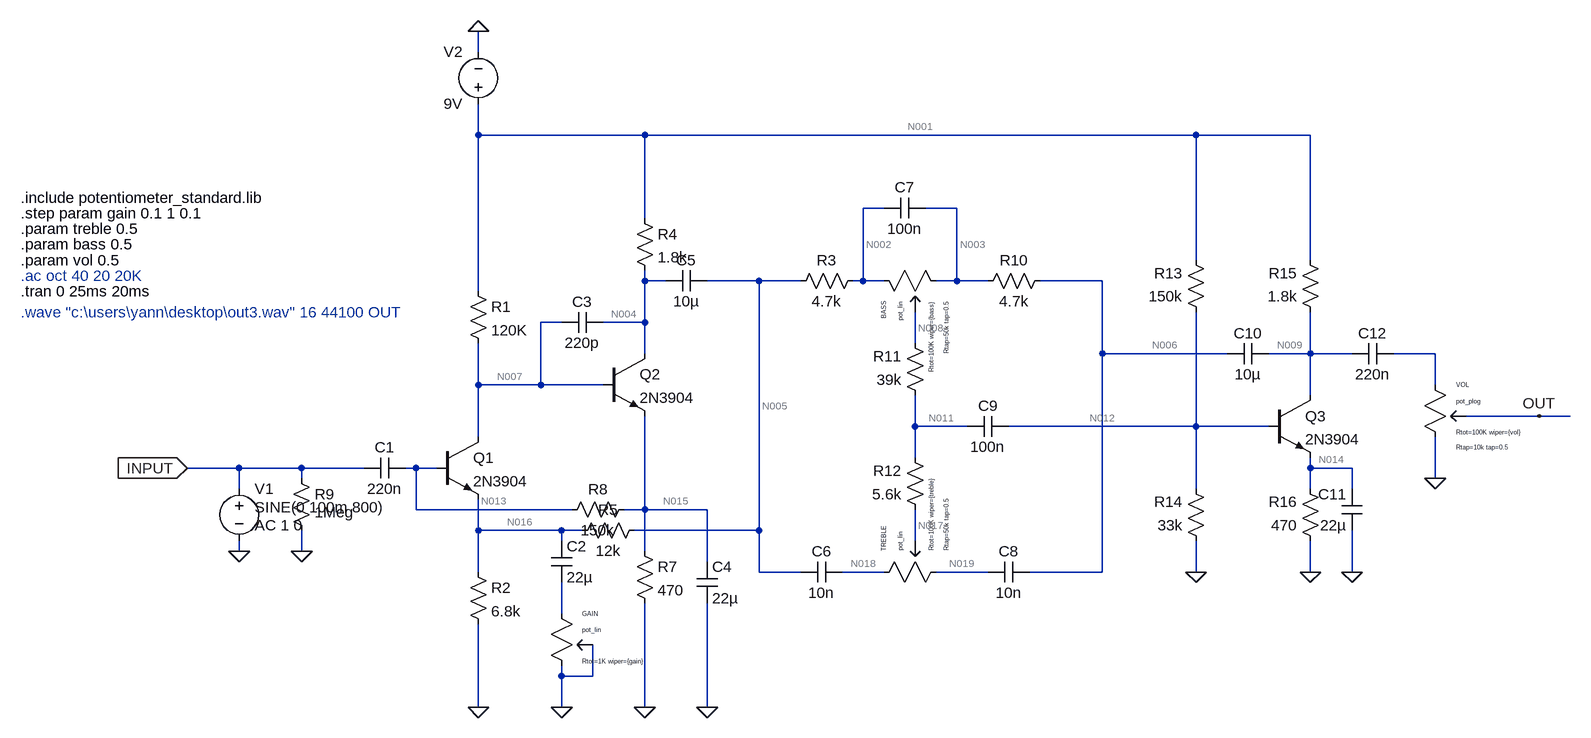
[diagram p0: schematic overdriver.asc]
overdriver.asc, the LTspice schematic file:
Version 4
SHEET 1 2004 680
WIRE 208 -448 208 -480
WIRE 208 -320 208 -368
WIRE 464 -320 208 -320
WIRE 1312 -320 464 -320
WIRE 1488 -320 1312 -320
WIRE 832 -208 800 -208
WIRE 944 -208 896 -208
WIRE 464 -192 464 -320
WIRE 1312 -128 1312 -320
WIRE 1488 -128 1488 -320
WIRE 464 -96 464 -112
WIRE 496 -96 464 -96
WIRE 640 -96 560 -96
WIRE 704 -96 640 -96
WIRE 800 -96 800 -208
WIRE 800 -96 784 -96
WIRE 832 -96 800 -96
WIRE 944 -96 944 -208
WIRE 944 -96 912 -96
WIRE 992 -96 944 -96
WIRE 1168 -96 1072 -96
WIRE 208 -80 208 -320
WIRE 336 -32 304 -32
WIRE 464 -32 464 -96
WIRE 464 -32 400 -32
WIRE 880 0 880 -48
WIRE 464 16 464 -32
WIRE 1168 16 1168 -96
WIRE 1360 16 1168 16
WIRE 1488 16 1488 -48
WIRE 1488 16 1424 16
WIRE 1552 16 1488 16
WIRE 1680 16 1616 16
WIRE 208 64 208 0
WIRE 304 64 304 -32
WIRE 304 64 208 64
WIRE 400 64 304 64
WIRE 1680 64 1680 16
WIRE 1488 80 1488 16
WIRE 1840 112 1728 112
WIRE 1888 112 1840 112
WIRE 880 128 880 80
WIRE 960 128 880 128
WIRE 1312 128 1312 -48
WIRE 1312 128 1024 128
WIRE 1424 128 1312 128
WIRE 208 144 208 64
WIRE 880 176 880 128
WIRE -160 192 -240 192
WIRE -64 192 -160 192
WIRE 32 192 -64 192
WIRE 112 192 96 192
WIRE 144 192 112 192
WIRE 1488 192 1488 176
WIRE 1552 192 1488 192
WIRE -64 208 -64 192
WIRE 1680 208 1680 144
WIRE -160 224 -160 192
WIRE 1312 224 1312 128
WIRE 1488 224 1488 192
WIRE 1552 224 1552 192
WIRE 112 256 112 192
WIRE 352 256 112 256
WIRE 464 256 464 112
WIRE 464 256 432 256
WIRE 560 256 464 256
WIRE 208 288 208 240
WIRE 336 288 208 288
WIRE 368 288 336 288
WIRE 640 288 640 -96
WIRE 640 288 448 288
WIRE 336 304 336 288
WIRE 880 304 880 256
WIRE -160 320 -160 304
WIRE -64 320 -64 288
WIRE 464 320 464 256
WIRE 560 336 560 256
WIRE 208 352 208 288
WIRE 640 352 640 288
WIRE 704 352 640 352
WIRE 832 352 768 352
WIRE 992 352 912 352
WIRE 1168 352 1168 16
WIRE 1168 352 1056 352
WIRE 1312 352 1312 304
WIRE 1488 352 1488 304
WIRE 1552 352 1552 288
WIRE 336 416 336 368
WIRE 336 512 336 496
WIRE 384 512 384 464
WIRE 384 512 336 512
WIRE 208 560 208 432
WIRE 336 560 336 512
WIRE 464 560 464 400
WIRE 560 560 560 400
FLAG -240 192 INPUT
IOPIN -240 192 In
FLAG -160 320 0
FLAG 208 560 0
FLAG 336 560 0
FLAG 208 -480 0
FLAG 464 560 0
FLAG 560 560 0
FLAG -64 320 0
FLAG 1312 352 0
FLAG 1488 352 0
FLAG 1552 352 0
FLAG 1680 208 0
FLAG 1840 112 OUT
SYMBOL cap 96 176 R90
WINDOW 0 0 32 VBottom 2
WINDOW 3 32 32 VTop 2
SYMATTR InstName C1
SYMATTR Value 220n
SYMBOL voltage -160 208 R0
WINDOW 3 24 44 Left 2
WINDOW 123 24 72 Left 2
WINDOW 39 0 0 Left 2
SYMATTR Value SINE(0 100m 800)
SYMATTR Value2 AC 1 0
SYMATTR InstName V1
SYMBOL npn 144 144 R0
SYMATTR InstName Q1
SYMATTR Value 2N3904
SYMBOL voltage 208 -352 R180
WINDOW 0 24 96 Left 2
WINDOW 3 24 16 Left 2
WINDOW 123 0 0 Left 2
WINDOW 39 0 0 Left 2
SYMATTR InstName V2
SYMATTR Value 9V
SYMBOL res 192 -96 R0
SYMATTR InstName R1
SYMATTR Value 120K
SYMATTR SpiceLine tol=1% pwr=0.25w
SYMBOL res 192 336 R0
SYMATTR InstName R2
SYMATTR Value 6.8k
SYMATTR SpiceLine tol=1% pwr=0.25W
SYMBOL cap 320 304 R0
SYMATTR InstName C2
SYMATTR Value 22µ
SYMBOL npn 400 16 R0
SYMATTR InstName Q2
SYMATTR Value 2N3904
SYMBOL res 448 -208 R0
SYMATTR InstName R4
SYMATTR Value 1.8k
SYMATTR SpiceLine tol=1% pwr=0.25w
SYMBOL cap 400 -48 R90
WINDOW 0 0 32 VBottom 2
WINDOW 3 32 32 VTop 2
SYMATTR InstName C3
SYMATTR Value 220p
SYMBOL res 448 304 R0
SYMATTR InstName R7
SYMATTR Value 470
SYMATTR SpiceLine tol=1% pwr=0.25w
SYMBOL res 448 240 R90
WINDOW 0 0 56 VBottom 2
WINDOW 3 32 56 VTop 2
SYMATTR InstName R8
SYMATTR Value 150k
SYMATTR SpiceLine tol=1% pwr=0.25w
SYMBOL cap 544 336 R0
SYMATTR InstName C4
SYMATTR Value 22µ
SYMBOL cap 560 -112 R90
WINDOW 0 0 32 VBottom 2
WINDOW 3 32 32 VTop 2
SYMATTR InstName C5
SYMATTR Value 10µ
SYMBOL res -80 192 R0
WINDOW 3 36 68 Left 2
SYMATTR Value 1Meg
SYMATTR InstName R9
SYMBOL potentiometer_standard 320 400 R0
WINDOW 39 48 69 Left 2
SYMATTR SpiceLine ""
SYMATTR InstName GAIN
SYMATTR Value Rtot=1K wiper={gain}
SYMBOL res 800 -112 R90
WINDOW 0 0 56 VBottom 2
WINDOW 3 32 56 VTop 2
SYMATTR InstName R3
SYMATTR Value 4.7k
SYMATTR SpiceLine tol=1% pwr=0.25w
SYMBOL cap 768 336 R90
WINDOW 0 0 32 VBottom 2
WINDOW 3 32 32 VTop 2
SYMATTR InstName C6
SYMATTR Value 10n
SYMBOL potentiometer_standard 816 368 R270
SYMATTR InstName TREBLE
SYMATTR Value Rtot=100K wiper={treble}
SYMATTR SpiceLine Rtap=50k tap=0.5
SYMBOL potentiometer_standard 816 -112 M90
SYMATTR InstName BASS
SYMATTR Value Rtot=100K wiper={bass}
SYMATTR SpiceLine Rtap=50k tap=0.5
SYMBOL res 1088 -112 R90
WINDOW 0 0 56 VBottom 2
WINDOW 3 32 56 VTop 2
SYMATTR InstName R10
SYMATTR Value 4.7k
SYMATTR SpiceLine tol=1% pwr=0.25w
SYMBOL cap 896 -224 R90
WINDOW 0 0 32 VBottom 2
WINDOW 3 32 32 VTop 2
SYMATTR InstName C7
SYMATTR Value 100n
SYMBOL cap 1056 336 R90
WINDOW 0 0 32 VBottom 2
WINDOW 3 32 32 VTop 2
SYMATTR InstName C8
SYMATTR Value 10n
SYMBOL res 896 96 R180
WINDOW 0 36 76 Left 2
WINDOW 3 36 40 Left 2
SYMATTR InstName R11
SYMATTR Value 39k
SYMATTR SpiceLine tol=1% pwr=0.25w
SYMBOL res 896 272 R180
WINDOW 0 36 76 Left 2
WINDOW 3 36 40 Left 2
SYMATTR InstName R12
SYMATTR Value 5.6k
SYMATTR SpiceLine tol=1% pwr=0.25w
SYMBOL cap 1024 112 R90
WINDOW 0 0 32 VBottom 2
WINDOW 3 32 32 VTop 2
SYMATTR InstName C9
SYMATTR Value 100n
SYMBOL res 1328 -32 R180
WINDOW 0 36 76 Left 2
WINDOW 3 36 40 Left 2
SYMATTR InstName R13
SYMATTR Value 150k
SYMATTR SpiceLine tol=1% pwr=0.25w
SYMBOL res 1328 320 R180
WINDOW 0 36 76 Left 2
WINDOW 3 36 40 Left 2
SYMATTR InstName R14
SYMATTR Value 33k
SYMATTR SpiceLine tol=1% pwr=0.25w
SYMBOL cap 1424 0 R90
WINDOW 0 0 32 VBottom 2
WINDOW 3 32 32 VTop 2
SYMATTR InstName C10
SYMATTR Value 10µ
SYMBOL res 1504 -32 R180
WINDOW 0 36 76 Left 2
WINDOW 3 36 40 Left 2
SYMATTR InstName R15
SYMATTR Value 1.8k
SYMATTR SpiceLine tol=1% pwr=0.25w
SYMBOL npn 1424 80 R0
SYMATTR InstName Q3
SYMATTR Value 2N3904
SYMBOL res 1504 320 R180
WINDOW 0 36 76 Left 2
WINDOW 3 36 40 Left 2
SYMATTR InstName R16
SYMATTR Value 470
SYMATTR SpiceLine tol=1% pwr=0.25w
SYMBOL cap 1568 288 R180
WINDOW 0 24 56 Left 2
WINDOW 3 24 8 Left 2
SYMATTR InstName C11
SYMATTR Value 22µ
SYMBOL cap 1616 0 R90
WINDOW 0 0 32 VBottom 2
WINDOW 3 32 32 VTop 2
SYMATTR InstName C12
SYMATTR Value 220n
SYMBOL potentiometer_standard 1664 48 R0
SYMATTR InstName VOL
SYMATTR Value Rtot=100K wiper={vol}
SYMATTR SpiceLine Rtap=10k tap=0.5
SYMATTR SpiceModel pot_plog
SYMBOL res 464 272 R90
WINDOW 0 0 56 VBottom 2
WINDOW 3 32 56 VTop 2
SYMATTR InstName R5
SYMATTR Value 12k
TEXT -496 -80 Left 2 !.tran 0 25ms 20ms
TEXT -496 -200 Left 2 !.step param gain 0.1 1 0.1
TEXT -496 -224 Left 2 !.include potentiometer_standard.lib
TEXT -496 -176 Left 2 !.param treble 0.5
TEXT -496 -152 Left 2 !.param bass 0.5
TEXT -496 -128 Left 2 !.param vol 0.5
TEXT -496 -104 Left 2 ;.ac oct 40 20 20K
TEXT -496 -48 Left 2 ;.wave "c:\\users\\yann\\desktop\\out3.wav" 16 44100 OUT

The netlist it stands for:
* overdriver.asc
C1 N013 INPUT 220n
V1 INPUT 0 SINE(0 100m 800) AC 1 0
Q1 N007 N013 N016 0 2N3904
V2 N001 0 9V
R1 N001 N007 120K tol=1% pwr=0.25w
R2 N016 0 6.8k tol=1% pwr=0.25W
C2 N016 N020 22µ
Q2 N004 N007 N015 0 2N3904
R4 N001 N004 1.8k tol=1% pwr=0.25w
C3 N004 N007 220p
R7 N015 0 470 tol=1% pwr=0.25w
R8 N015 N013 150k tol=1% pwr=0.25w
C4 N015 0 22µ
C5 N005 N004 10µ
R9 INPUT 0 1Meg
XGAIN N020 0 0 pot_lin Rtot=1K wiper={gain}  ; pins A B C
R3 N002 N005 4.7k tol=1% pwr=0.25w
C6 N018 N005 10n
XTREBLE N018 N019 N017 pot_lin Rtot=100K wiper={treble} Rtap=50k tap=0.5  ; pins A B C
XBASS N002 N003 N008 pot_lin Rtot=100K wiper={bass} Rtap=50k tap=0.5  ; pins A B C
R10 N006 N003 4.7k tol=1% pwr=0.25w
C7 N003 N002 100n
C8 N006 N019 10n
R11 N011 N008 39k tol=1% pwr=0.25w
R12 N017 N011 5.6k tol=1% pwr=0.25w
C9 N012 N011 100n
R13 N012 N001 150k tol=1% pwr=0.25w
R14 0 N012 33k tol=1% pwr=0.25w
C10 N009 N006 10µ
R15 N009 N001 1.8k tol=1% pwr=0.25w
Q3 N009 N012 N014 0 2N3904
R16 0 N014 470 tol=1% pwr=0.25w
C11 0 N014 22µ
C12 N010 N009 220n
XVOL N010 0 OUT pot_plog Rtot=100K wiper={vol} Rtap=10k tap=0.5  ; pins A B C
R5 N005 N016 12k
.model NPN NPN
.model PNP PNP
.lib standard.bjt
.tran 0 25ms 20ms
.step param gain 0.1 1 0.1
.include potentiometer_standard.lib
.param treble 0.5
.param bass 0.5
.param vol 0.5
* .ac oct 40 20 20K
* .wave "c:\users\yann\desktop\out3.wav" 16 44100 OUT
.backanno
.end

* Results of the author's LTspice run, read from the files saved beside the schematic
* Operating Point (first step), zero values left out:
*   gain = 100 m
*   V(n013) = 951.7 mV
*   V(n007) = 1.652 V
*   V(n016) = 372 mV
*   V(n001) = 9 V
*   V(n004) = 5.263 V
*   V(n015) = 978.7 mV
*   V(n005) = 372 mV
*   V(n002) = 372 mV
*   V(n018) = 372 mV
*   V(n017) = 372 mV
*   V(n019) = 372 mV
*   V(n008) = 372 mV
*   V(n003) = 372 mV
*   V(n006) = 372 mV
*   V(n011) = 372 mV
*   V(n012) = 1.475 V
*   V(n009) = 5.921 V
*   V(n014) = 806.4 mV
*   Ic(Q3) = 1.71 mA
*   Ib(Q3) = 5.481 µA
*   Ie(Q3) = -1.716 mA
*   Ic(Q2) = 2.076 mA
*   Ib(Q2) = 6.712 µA
*   Ie(Q2) = -2.083 mA
*   Ic(Q1) = 54.52 µA
*   Ib(Q1) = 180.5 nA
*   Ie(Q1) = -54.7 µA
*   I(R16) = -1.716 mA
*   I(R15) = -1.71 mA
*   I(R14) = -44.69 µA
*   I(R13) = -50.17 µA
*   I(R8) = 180.5 nA
*   I(R7) = 2.082 mA
*   I(R4) = 2.076 mA
*   I(R2) = 54.7 µA
*   I(R1) = 61.23 µA
*   I(V2) = -3.898 mA
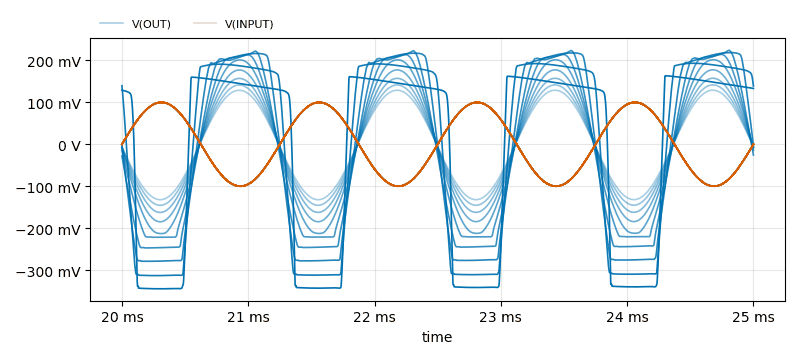
[diagram p1: Transient Analysis of overdriver.asc, plotted from the saved traces]
* Transient Analysis, 10 runs:
*   V(OUT) [gain=0.1]: min -131.8 mV, max 128.7 mV, average -632.4 µV, rms 92.25 mV, last -5.689 mV
*   V(OUT) [gain=0.2]: min -145.1 mV, max 141.3 mV, average -711.3 µV, rms 101.5 mV, last -6.174 mV
*   V(OUT) [gain=0.3]: min -162.1 mV, max 157.1 mV, average -811.6 µV, rms 113.2 mV, last -6.743 mV
*   V(OUT) [gain=0.4]: min -184.4 mV, max 177.2 mV, average -956.2 µV, rms 128.4 mV, last -7.383 mV
*   V(OUT) [gain=0.5]: min -212.3 mV, max 201.1 mV, average -1.286 mV, rms 148.6 mV, last -8.008 mV
*   V(OUT) [gain=0.6]: min -221.1 mV, max 213.8 mV, average -4.079 mV, rms 167.9 mV, last -14.41 mV
*   V(OUT) [gain=0.7]: min -246.5 mV, max 223.4 mV, average -11.2 mV, rms 189 mV, last -25.62 mV
*   V(OUT) [gain=0.8]: min -278.2 mV, max 218 mV, average -12.19 mV, rms 212.3 mV, last -3.024 mV
*   V(INPUT) [gain=0.1]: min -99.76 mV, max 99.73 mV, average -77.52 nV, rms 70.53 mV, last 0 V
*   V(INPUT) [gain=0.2]: min -99.76 mV, max 99.73 mV, average -77.52 nV, rms 70.53 mV, last 0 V
*   V(INPUT) [gain=0.3]: min -99.76 mV, max 99.73 mV, average -77.1 nV, rms 70.53 mV, last 0 V
*   V(INPUT) [gain=0.4]: min -99.76 mV, max 99.73 mV, average -77.52 nV, rms 70.53 mV, last 0 V
*   V(INPUT) [gain=0.5]: min -99.75 mV, max 99.84 mV, average 9.266 µV, rms 70.54 mV, last 0 V
*   V(INPUT) [gain=0.6]: min -99.71 mV, max 99.74 mV, average 39.23 µV, rms 70.58 mV, last 0 V
*   V(INPUT) [gain=0.7]: min -99.76 mV, max 99.73 mV, average 8.442 µV, rms 70.59 mV, last 0 V
*   V(INPUT) [gain=0.8]: min -99.76 mV, max 99.74 mV, average 12.77 µV, rms 70.55 mV, last 0 V